# Altium schematic sheet 9 onboard.SchDoc
size A4; SheetNumber: 12; SheetTotal: 13
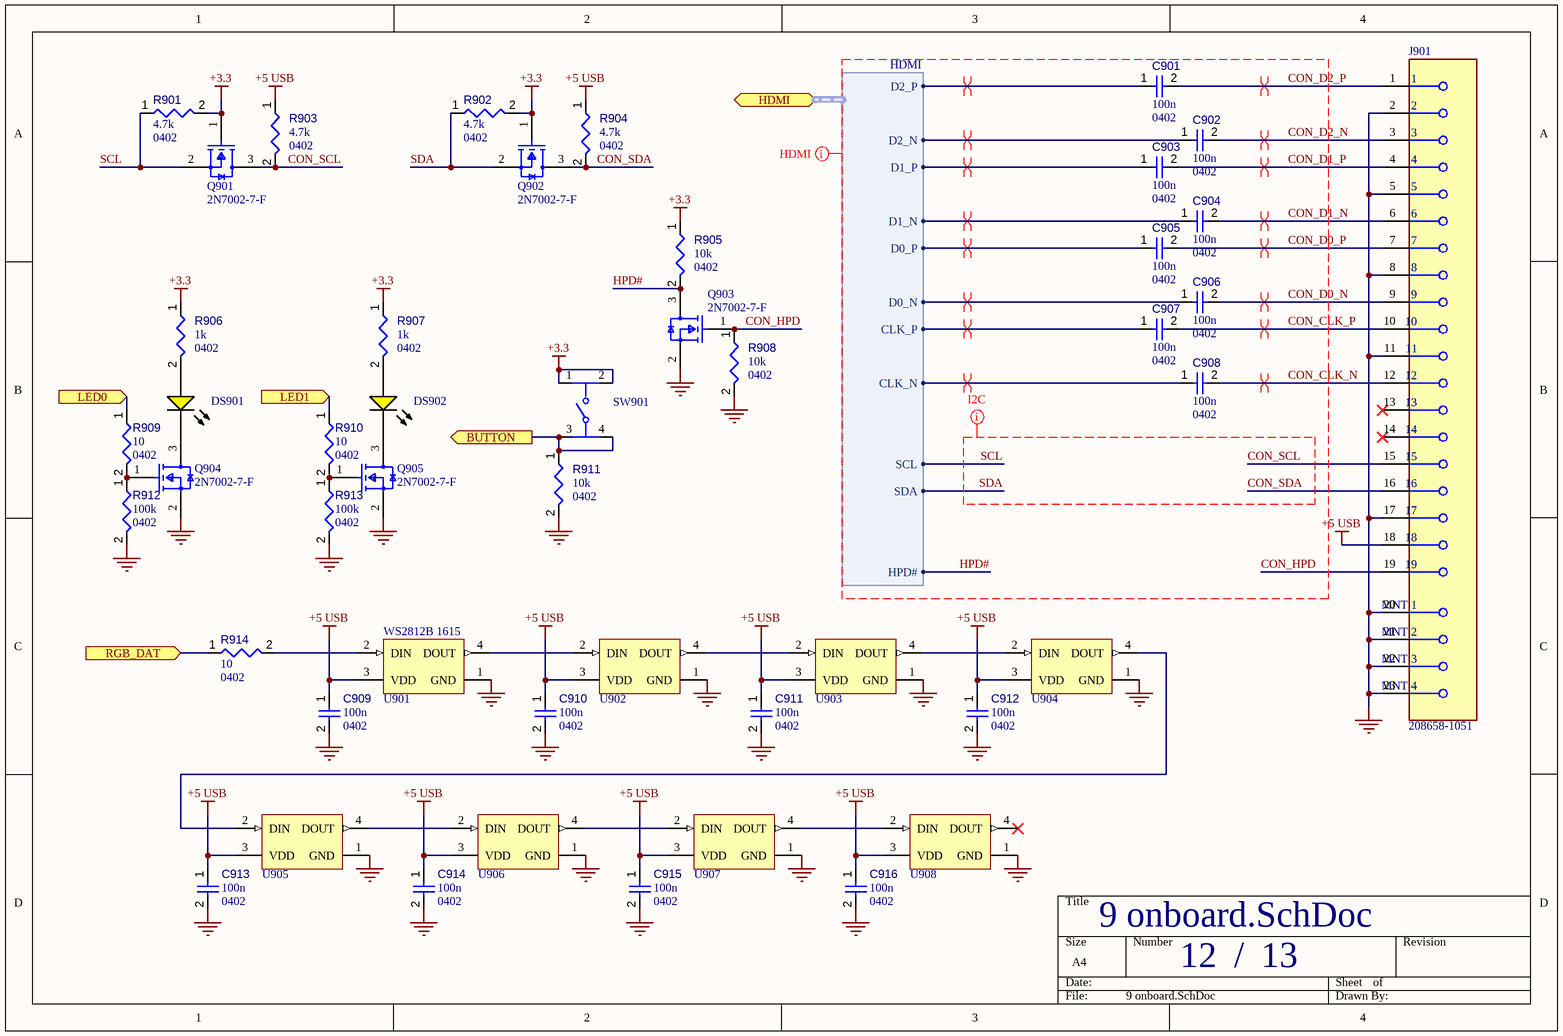
[diagram p0: 9 onboard.SchDoc]

## Parts
C901  value 100n  Case/Package: 0402  [CAPC0402(1005)60_L]  (hidden comment: Capacitors,0402,100n,16)
C902  value 100n  Case/Package: 0402  [CAPC0402(1005)60_L]  (hidden comment: Capacitors,0402,100n,16)
C903  value 100n  Case/Package: 0402  [CAPC0402(1005)60_L]  (hidden comment: Capacitors,0402,100n,16)
C904  value 100n  Case/Package: 0402  [CAPC0402(1005)60_L]  (hidden comment: Capacitors,0402,100n,16)
C905  value 100n  Case/Package: 0402  [CAPC0402(1005)60_L]  (hidden comment: Capacitors,0402,100n,16)
C906  value 100n  Case/Package: 0402  [CAPC0402(1005)60_L]  (hidden comment: Capacitors,0402,100n,16)
C907  value 100n  Case/Package: 0402  [CAPC0402(1005)60_L]  (hidden comment: Capacitors,0402,100n,16)
C908  value 100n  Case/Package: 0402  [CAPC0402(1005)60_L]  (hidden comment: Capacitors,0402,100n,16)
C909  value 100n  Case/Package: 0402  [CAPC0402(1005)60_L]  (hidden comment: Capacitors,0402,100n,16)
C910  value 100n  Case/Package: 0402  [CAPC0402(1005)60_L]  (hidden comment: Capacitors,0402,100n,16)
C911  value 100n  Case/Package: 0402  [CAPC0402(1005)60_L]  (hidden comment: Capacitors,0402,100n,16)
C912  value 100n  Case/Package: 0402  [CAPC0402(1005)60_L]  (hidden comment: Capacitors,0402,100n,16)
C913  value 100n  Case/Package: 0402  [CAPC0402(1005)60_L]  (hidden comment: Capacitors,0402,100n,16)
C914  value 100n  Case/Package: 0402  [CAPC0402(1005)60_L]  (hidden comment: Capacitors,0402,100n,16)
C915  value 100n  Case/Package: 0402  [CAPC0402(1005)60_L]  (hidden comment: Capacitors,0402,100n,16)
C916  value 100n  Case/Package: 0402  [CAPC0402(1005)60_L]  (hidden comment: Capacitors,0402,100n,16)
DS901  SML-LX0603YW-TR  [LUMX-SML-LX0603_V]  (value not drawn)
DS902  SML-LX0603YW-TR  [LUMX-SML-LX0603_V]  (value not drawn)
J901  208658-1051  [FP-208658-1051-MFG]
Q901  2N7002-7-F  [FP-SOT23-MFG]
Q902  2N7002-7-F  [FP-SOT23-MFG]
Q903  2N7002-7-F  [FP-SOT23-MFG]
Q904  2N7002-7-F  [FP-SOT23-MFG]
Q905  2N7002-7-F  [FP-SOT23-MFG]
R901  value 4.7k  Case/Package: 0402  [RESC0402(1005)_L]  (hidden comment: Resistors,0402,4.7k)
R902  value 4.7k  Case/Package: 0402  [RESC0402(1005)_L]  (hidden comment: Resistors,0402,4.7k)
R903  value 4.7k  Case/Package: 0402  [RESC0402(1005)_L]  (hidden comment: Resistors,0402,4.7k)
R904  value 4.7k  Case/Package: 0402  [RESC0402(1005)_L]  (hidden comment: Resistors,0402,4.7k)
R905  value 10k  Case/Package: 0402  [RESC0402(1005)_L]  (hidden comment: Resistors,0402,10k)
R906  value 1k  Case/Package: 0402  [RESC0402(1005)_L]  (hidden comment: Resistors,0402,1k)
R907  value 1k  Case/Package: 0402  [RESC0402(1005)_L]  (hidden comment: Resistors,0402,1k)
R908  value 10k  Case/Package: 0402  [RESC0402(1005)_L]  (hidden comment: Resistors,0402,10k)
R909  value 10  Case/Package: 0402  [RESC0402(1005)_L]  (hidden comment: Resistors,0402,10)
R910  value 10  Case/Package: 0402  [RESC0402(1005)_L]  (hidden comment: Resistors,0402,10)
R911  value 10k  Case/Package: 0402  [RESC0402(1005)_L]  (hidden comment: Resistors,0402,10k)
R912  value 100k  Case/Package: 0402  [RESC0402(1005)_L]  (hidden comment: Resistors,0402,1%,100k)
R913  value 100k  Case/Package: 0402  [RESC0402(1005)_L]  (hidden comment: Resistors,0402,1%,100k)
R914  value 10  Case/Package: 0402  [RESC0402(1005)_L]  (hidden comment: Resistors,0402,10)
SW901  PTS810SJM250SMTRLFS  [FP-PTS810SJM250SMTRLFS-MFG]  (value not drawn)
U901  WS2812B 1615  [WS2812B 1615]
U902  WS2812B 1615  [WS2812B 1615]  (value not drawn)
U903  WS2812B 1615  [WS2812B 1615]  (value not drawn)
U904  WS2812B 1615  [WS2812B 1615]  (value not drawn)
U905  WS2812B 1615  [WS2812B 1615]  (value not drawn)
U906  WS2812B 1615  [WS2812B 1615]  (value not drawn)
U907  WS2812B 1615  [WS2812B 1615]  (value not drawn)
U908  WS2812B 1615  [WS2812B 1615]  (value not drawn)

## Ports
BUTTON (out), HDMI (bidir, harness HDMI), LED0 (in), LED1 (in), RGB_DAT (in)

## Harnesses
HDMI: D0_P, D0_N, D1_P, D1_N, D2_P, D2_N, CLK_P, CLK_N, SCL, SDA, HPD#

## Nets
+3.3: Q901.1(G) Q902.1(G) R901.2 R902.2 R905.1 R906.1 R907.1 SW901.1 SW901.2
+5 USB: C909.1 C910.1 C911.1 C912.1 C913.1 C914.1 C915.1 C916.1 J901.18 R903.1 R904.1 U901.3(VDD) U902.3(VDD) U903.3(VDD) U904.3(VDD) U905.3(VDD) U906.3(VDD) U907.3(VDD) U908.3(VDD)
GND: C909.2 C910.2 C911.2 C912.2 C913.2 C914.2 C915.2 C916.2 J901.2 J901.5 J901.8 J901.11 J901.17 J901.20(MNT_1) J901.21(MNT_2) J901.22(MNT_3) J901.23(MNT_4) Q903.2(S) Q904.2(S) Q905.2(S) R908.2 R911.2 R912.2 R913.2 U901.1(GND) U902.1(GND) U903.1(GND) U904.1(GND) U905.1(GND) U906.1(GND) U907.1(GND) U908.1(GND)
BUTTON: R911.1 SW901.3 SW901.4 ; port BUTTON
CON_CLK_N: C908.2 J901.12
CON_CLK_P: C907.2 J901.10
CON_D0_N: C906.2 J901.9
CON_D0_P: C905.2 J901.7
CON_D1_N: C904.2 J901.6
CON_D1_P: C903.2 J901.4
CON_D2_N: C902.2 J901.3
CON_D2_P: C901.2 J901.1
CON_HPD: J901.19 Q903.1(G) R908.1
CON_SCL: J901.15 Q901.3(D) R903.2
CON_SDA: J901.16 Q902.3(D) R904.2
HPD#: Q903.3(D) R905.2 ; port HDMI.HPD#
LED0: R909.1 ; port LED0
LED1: R910.1 ; port LED1
RGB_DAT: R914.1 ; port RGB_DAT
SCL: Q901.2(S) R901.1 ; port HDMI.SCL
SDA: Q902.2(S) R902.1 ; port HDMI.SDA
NetC901_1: C901.1 ; port HDMI.D2_P
NetC902_1: C902.1 ; port HDMI.D2_N
NetC903_1: C903.1 ; port HDMI.D1_P
NetC904_1: C904.1 ; port HDMI.D1_N
NetC905_1: C905.1 ; port HDMI.D0_P
NetC906_1: C906.1 ; port HDMI.D0_N
NetC907_1: C907.1 ; port HDMI.CLK_P
NetC908_1: C908.1 ; port HDMI.CLK_N
NetDS901_1: DS901.1(A) R906.2
NetDS901_2: DS901.2(K) Q904.3(D)
NetDS902_1: DS902.1(A) R907.2
NetDS902_2: DS902.2(K) Q905.3(D)
NetQ904_1: Q904.1(G) R909.2 R912.1
NetQ905_1: Q905.1(G) R910.2 R913.1
NetR914_2: R914.2 U901.2(DIN)
NetU901_4: U901.4(DOUT) U902.2(DIN)
NetU902_4: U902.4(DOUT) U903.2(DIN)
NetU903_4: U903.4(DOUT) U904.2(DIN)
NetU904_4: U904.4(DOUT) U905.2(DIN)
NetU905_4: U905.4(DOUT) U906.2(DIN)
NetU906_4: U906.4(DOUT) U907.2(DIN)
NetU907_4: U907.4(DOUT) U908.2(DIN)

Not connected (* = marked no-connect by the designer): J901 13* 14*; U908 4(DOUT)*

## Layout directives
differential pair: CON_CLK_N, CON_CLK_P, CON_D0_N, CON_D0_P, CON_D1_N, CON_D1_P, CON_D2_N, CON_D2_P, NetC901_1, NetC902_1, NetC903_1, NetC904_1, NetC905_1, NetC906_1, NetC907_1, NetC908_1
net class HDMI: CON_CLK_N, CON_CLK_P, CON_D0_N, CON_D0_P, CON_D1_N, CON_D1_P, CON_D2_N, CON_D2_P, CON_HPD, CON_SCL, CON_SDA, HPD#, SCL, SDA
net class I2C: CON_SCL, CON_SDA, SCL, SDA

## Notes on the sheet
- /

## Library data of the parts
C901-C916 = Capacitors: Capacitor; Voltage Rating: 16; Component Type: Capacitors
DS901 DS902 = CMP-2000-07121-1: Yellow LED, Milky White Diffused Lens, 2.1 V, 14 mcd, -25 to 85 degC, 2-Pin SMD, RoHS, Tape and Reel; Manufacturer: Lumex; COO: CN; Number of LEDs: 1; Type: Uni-Color; Intensity: 14mcd; Reverse Voltage: 5(Min)V; LED Material: GaAsP; Viewing Angle: 160; Peak Wavelength: 585nm; Pin_Count: 2; Lens Appearance: ColorlessDiffused; Operating Temperature: -25to85C; Color: Yellow; Mounting Technology: SurfaceMount; Package Description: 2-Pin Surface Mount Device, Body 1.6 x 0.8 mm; Mounting: SurfaceMount; Packaging: TapeandReel; RoHS: Unknown; Supplier_Package: SMD; Package Reference: SML-LX00603; Part No: SML-LX0603YW-TR; Datasheet URL: http://www.lumex.com/content/files/ProductAttachment/SML-LX0603YW-TR.pdf; Dimension: 1.6x0.8x0.6mm; Manufacturer URL: http://www.lumexinstruments.com/; HTS: 8541402000; Datasheet Version: Rev. G, 09/2013; Lens Dimensions: 1x0.8x0.3mm; Dominant Wavelength: N/A; ECCN: EARII; Supplier: Lumex; Family: SML-LX0603YW
J901 = CMP-04768-000005-1: CONN RCPT HDMI V2.1 19POS SMD RA
Q901-Q905 = CMP-2000-04929-2: MOSFET N-CH 60V 115MA SOT23-3; Turn-On Delay Time: 7ns; Turn-Off Delay Time: 11ns; Drain to Source Resistance: 7.5R; Rise Time: 3ns; Drain to Source Breakdown Voltage: 70V; Input Capacitance: 50pF; Number of Elements: 1; Power Dissipation: 540mW; Max Power Dissipation: 300mW; Fall Time: 5.6ns; Gate to Source Voltage (Vgs): 20V; Threshold Voltage: 2.5V; Element Configuration: Single; Termination: SMD/SMT; Weight: 0.000282oz; Radiation Hardening: No; Max Operating Temperature: 150°C; On-State Resistance: 7.5R; Mount: Surface Mount; Current Rating: 115mA; Contact Plating: Tin; Lead Free: Lead Free; Min Operating Temperature: -55°C; Number of Pins: 3; REACH SVHC: No SVHC; Drain to Source Voltage (Vdss): 60V; Width: 1.3mm; Package Quantity: 3000; Length: 2.9mm; Case/Package: SOT-23; Number of Channels: 1; Dual Supply Voltage: 60V; Packaging: Tape and Reel; Height: 1mm; Voltage Rating (DC): 60V; Nominal Vgs: 2.5V; Continuous Drain Current (ID): 115mA; Voltage: 60V; Rds On Max: 7.5R
R901-R914 = Resistors: Resistor; Component Type: Resistors
  R912 R913: Tolerance: 1%
SW901 = CMP-10040-000001-2: SWITCH TACTILE SPST-NO 0.05A 16V; Throw Configuration: SPST; Operating Force: 160gf; Actuator Type: Standard; Switch Travel: 0.15mm; Switch Function: Off-Mom; Max Current Rating: 50mA; Mechanical Life: 150000Cycles; Illumination Type: Non-Illuminated; Package Quantity: 2900; Depth: 4.6mm; Mount: Surface Mount; Packaging: Tape and Reel; Length: 3.2mm; RoHS Compliant: Yes; Case/Package: SMD/SMT; Voltage Rating (DC): 16V; Min Operating Temperature: -40°C; Termination: J-Bend; Lead Free: Lead Free; Contact Plating: Silver; Orientation: Straight; Max Operating Temperature: 85°C; Current Rating: 50mA; Color: Black